# EAGLE board SAP-1 (EAGLE 9.5.1), part 1 of 2
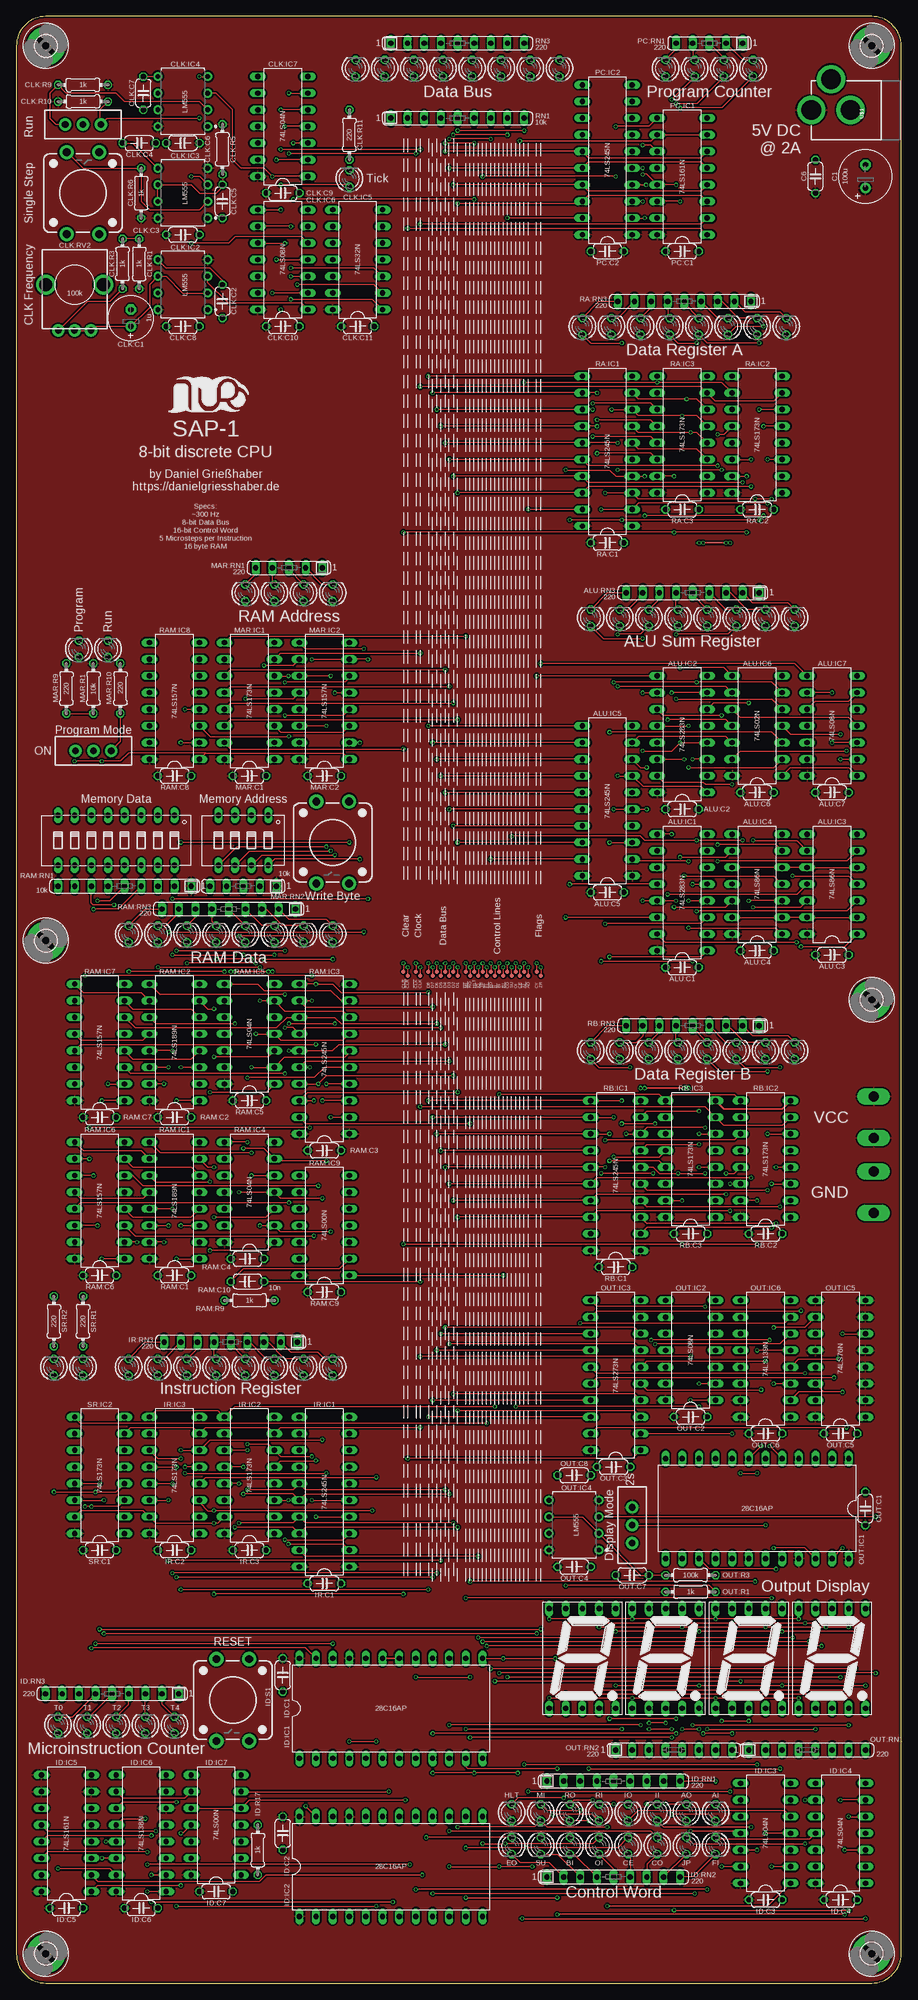
[diagram p12: board, top side]
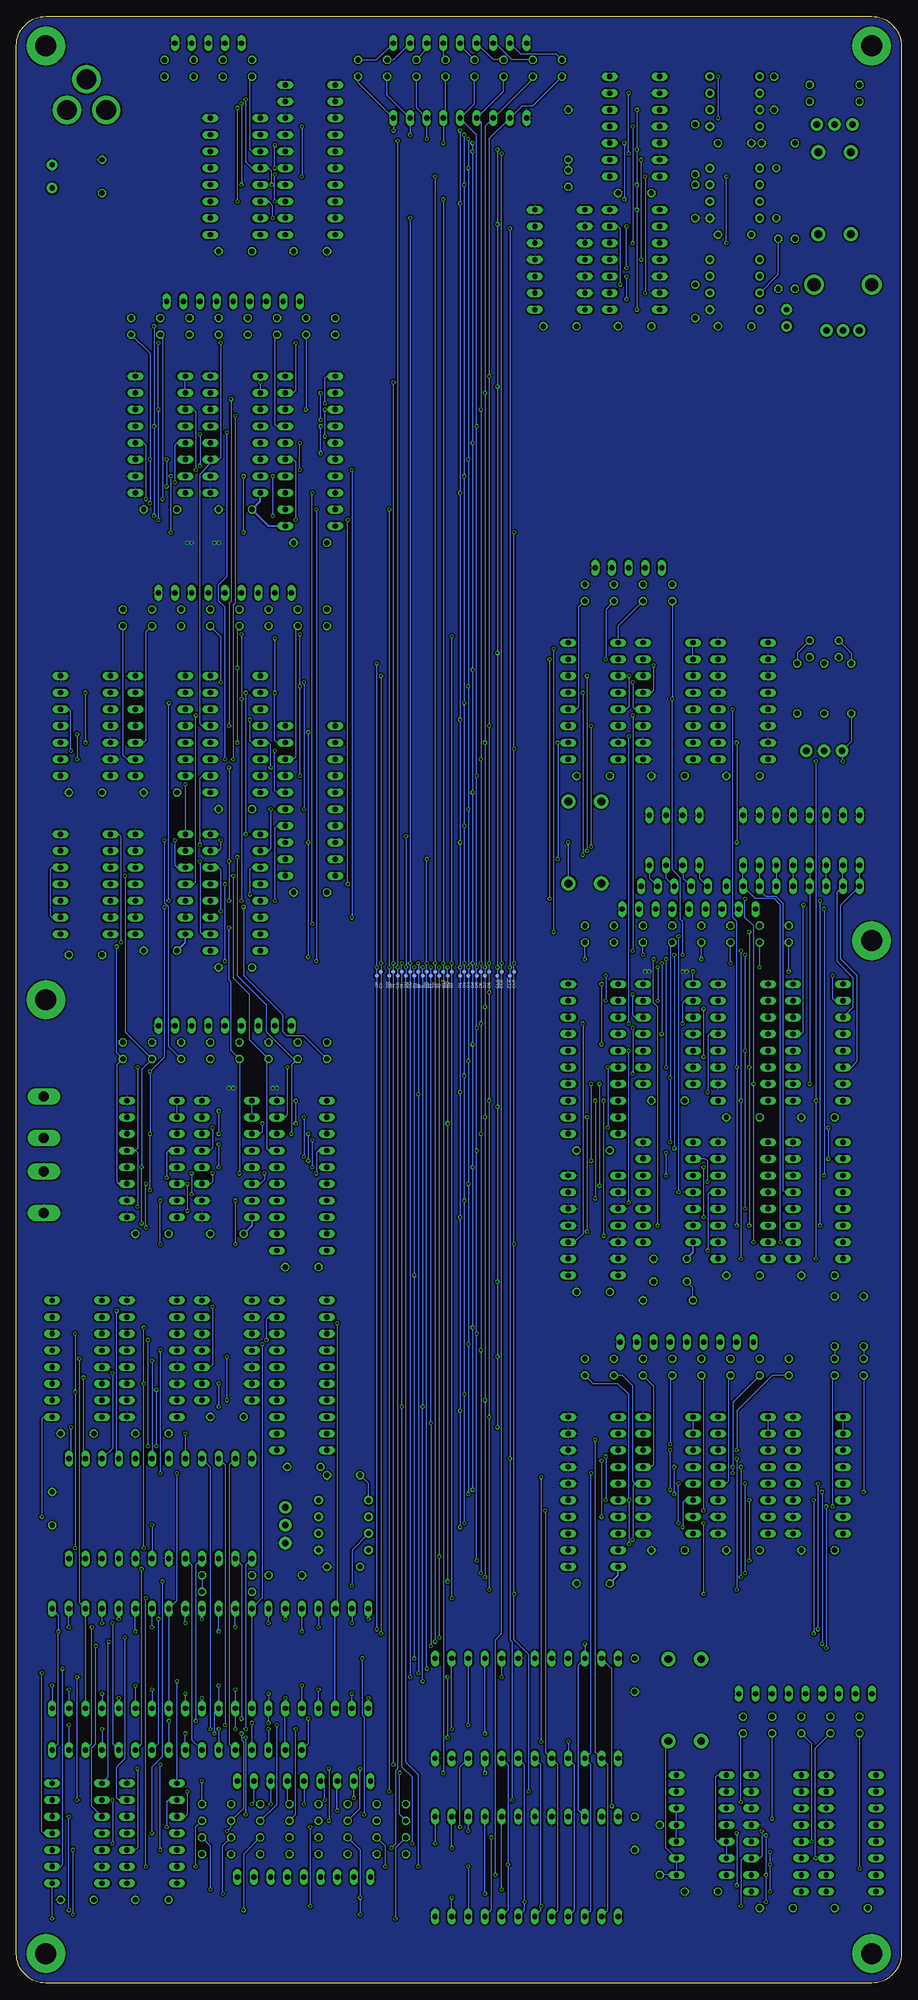
[diagram p13: board, bottom side, seen from below]

Size 135 x 300 mm. Coordinates in mm from the lower left corner, seen from the top.
Outline: 0,295.5 0,4.5 arc90 4.5,0 130.5,0 arc90 135,4.5 135,295.5 arc90 130.5,300 4.5,300 arc90 0,295.5
Copper layers (1*16): Top 0.035mm / dielectric 1.5mm / Bottom 0.035mm
Design rules "JLCPCB-Tented *": minimum track width 3.5mil, minimum drill 0.2mm, track to track 3.5mil, track to pad 5mil, pad to pad 6mil, via to via 6mil, smd to smd 3.5mil, copper to edge 0.2mm, drill to drill 5mil, minimum pad ring 3mil, minimum via ring 3mil, stop-mask expansion 4mil, vias tented up to drill 40mil, thermal gap 10mil
Net classes: 1 pwr: width 0.254 mm; 2 io: width 0.152 mm

## Footprints (pad centres in the part's own frame; a part is rotated, then mirrored left to right if it is on the bottom)
C050-024X044 = drill 0.813 octagon: 1 -2.54,0; 2 2.54,0
DIL16 = drill 0.813 long: 1 -8.89,-3.81; 2 -6.35,-3.81; 3 -3.81,-3.81; 4 -1.27,-3.81; 5 1.27,-3.81; 6 3.81,-3.81; 7 6.35,-3.81; 8 8.89,-3.81; 9 8.89,3.81; 10 6.35,3.81; 11 3.81,3.81; 12 1.27,3.81; 13 -1.27,3.81; 14 -3.81,3.81; 15 -6.35,3.81; 16 -8.89,3.81
DIL14 = drill 0.813 long: 1 -7.62,-3.81; 2 -5.08,-3.81; 3 -2.54,-3.81; 4 0,-3.81; 5 2.54,-3.81; 6 5.08,-3.81; 7 7.62,-3.81; 8 7.62,3.81; 9 5.08,3.81; 10 2.54,3.81; 11 0,3.81; 12 -2.54,3.81; 13 -5.08,3.81; 14 -7.62,3.81
DIL20 = drill 0.813 long: 1 -11.43,-3.81; 2 -8.89,-3.81; 3 -6.35,-3.81; 4 -3.81,-3.81; 5 -1.27,-3.81; 6 1.27,-3.81; 7 3.81,-3.81; 8 6.35,-3.81; 9 8.89,-3.81; 10 11.43,-3.81; 11 11.43,3.81; 12 8.89,3.81; 13 6.35,3.81; 14 3.81,3.81; 15 1.27,3.81; 16 -1.27,3.81; 17 -3.81,3.81; 18 -6.35,3.81; 19 -8.89,3.81; 20 -11.43,3.81
LED3MM = drill 0.813 octagon: A -1.27,0; K 1.27,0
SIL9 = drill 0.813 long: 1 -10.16,0; 2 -7.62,0; 3 -5.08,0; 4 -2.54,0; 5 0,0; 6 2.54,0; 7 5.08,0; 8 7.62,0; 9 10.16,0
E3,5-8 = drill 0.813 pad 1.6: + -1.778,0 | drill 0.813 pad 1.6 octagon: - 1.778,0
E2,5-7 = drill 0.813 pad 1.6: + -1.27,0 | drill 0.813 pad 1.6 octagon: - 1.27,0
DIP8 = drill 0.743 pad 1.343: 1 -3.81,3.81; 2 -3.81,1.27; 3 -3.81,-1.27; 4 -3.81,-3.81; 5 3.81,-3.81; 6 3.81,-1.27; 7 3.81,1.27; 8 3.81,3.81
0204/7 = drill 0.813 octagon: 1 -3.81,0; 2 3.81,0
ALPS_POT_KIT = drill 1 pad 1.88: P$1 7,-2.5; P$2 7,0; P$3 7,2.5 | drill 2: P$4 0,-4.4; P$5 0,4.4
TACTILE_SWITCH_PTH_12MM = drill 1.2 pad 2.159: 1 6.25,-2.5; 2 -6.25,-2.5; 3 6.25,2.5; 4 -6.25,2.5
SWITCH_SPDT_PTH_11.6X4.0MM_KIT = drill 1.016 pad 1.88: 1 0,2.718; 2 0,0; 3 0,-2.718
TP06R = smd 0.6 x 0.6: TP 0,0
3,2-PAD = drill 3.2 pad 5.842: B3,2 0,0
DIL24-6 = drill 0.813 long: 1 -13.97,-7.62; 2 -11.43,-7.62; 3 -8.89,-7.62; 4 -6.35,-7.62; 5 -3.81,-7.62; 6 -1.27,-7.62; 7 1.27,-7.62; 8 3.81,-7.62; 9 6.35,-7.62; 10 8.89,-7.62; 11 11.43,-7.62; 12 13.97,-7.62; 13 13.97,7.62; 14 11.43,7.62; 15 8.89,7.62; 16 6.35,7.62; 17 3.81,7.62; 18 1.27,7.62; 19 -1.27,7.62; 20 -3.81,7.62; 21 -6.35,7.62; 22 -8.89,7.62; 23 -11.43,7.62; 24 -13.97,7.62
VOGT-1098A.68 = drill 1.5 pad 2.5 long: P$1 -3.15,0; P$2 3.15,0
SIL5 = drill 0.813 long: 1 -5.08,0; 2 -2.54,0; 3 0,0; 4 2.54,0; 5 5.08,0
DIP04YL = drill 0.813 long: 1 -3.81,-3.81; 2 -1.27,-3.81; 3 1.27,-3.81; 4 3.81,-3.81; 5 3.81,3.81; 6 1.27,3.81; 7 -1.27,3.81; 8 -3.81,3.81
7SEG-13 = drill 0.813 long: 1 -5.08,-7.62; 2 -2.54,-7.62; 3 0,-7.62; 4 2.54,-7.62; 5 5.08,-7.62; 6 5.08,7.62; 7 2.54,7.62; 8 0,7.62; 9 -2.54,7.62; 10 -5.08,7.62
SIL8 = drill 0.813 long: 1 -8.89,0; 2 -6.35,0; 3 -3.81,0; 4 -1.27,0; 5 1.27,0; 6 3.81,0; 7 6.35,0; 8 8.89,0
DIP08YL = drill 0.813 long: 1 -8.89,-3.81; 2 -6.35,-3.81; 3 -3.81,-3.81; 4 -1.27,-3.81; 5 1.27,-3.81; 6 3.81,-3.81; 7 6.35,-3.81; 8 8.89,-3.81; 9 8.89,3.81; 10 6.35,3.81; 11 3.81,3.81; 12 1.27,3.81; 13 -1.27,3.81; 14 -3.81,3.81; 15 -6.35,3.81; 16 -8.89,3.81
POWER_JACK_PTH = drill 2.997 pad 4.318: GND 0,7.7; GNDBREAK 4.7,10.7; PWR 0,13.7

## Placement (x,y rotation side)
ALU:C1  100n  [C050-024X044]  101.6,154.94 0 top
ALU:C2  100n  [C050-024X044]  101.6,179.07 0 top
ALU:C3  100n  [C050-024X044]  124.46,156.84 0 top
ALU:C4  100n  [C050-024X044]  113.03,157.48 0 top
ALU:C5  100n  [C050-024X044]  90.17,166.37 0 top
ALU:C6  100n  [C050-024X044]  113.03,181.61 0 top
ALU:C7  100n  [C050-024X044]  124.46,181.61 0 top
ALU:IC1  74LS283N  [DIL16]  101.6,166.37 90 top
ALU:IC2  74LS283N  [DIL16]  101.6,190.5 90 top
ALU:IC3  74LS86N  [DIL14]  124.46,167.64 90 top
ALU:IC4  74LS86N  [DIL14]  113.03,167.64 90 top
ALU:IC5  74LS245N  [DIL20]  90.17,180.34 90 top
ALU:IC6  74LS02N  [DIL14]  113.03,191.77 90 top
ALU:IC7  74LS08N  [DIL14]  124.46,191.77 90 top
ALU:LED1  RED  [LED3MM]  118.75,208.28 90 top
ALU:LED2  RED  [LED3MM]  114.3,208.28 90 top
ALU:LED3  RED  [LED3MM]  109.86,208.28 90 top
ALU:LED4  RED  [LED3MM]  105.41,208.28 90 top
ALU:LED5  RED  [LED3MM]  100.97,208.28 90 top
ALU:LED6  RED  [LED3MM]  96.52,208.28 90 top
ALU:LED7  RED  [LED3MM]  92.08,208.28 90 top
ALU:LED8  RED  [LED3MM]  87.63,208.28 90 top
ALU:RN3  220  [SIL9]  103.19,212.09 180 top
C1  100u  [E3,5-8]  129.54,275.59 90 top
C6  100n  [C050-024X044]  121.92,275.59 90 top
CLK:C1  1u  [E2,5-7]  17.46,254 90 top
CLK:C2  100n  [C050-024X044]  31.43,256.54 270 top
CLK:C3  100n  [C050-024X044]  25.4,266.7 0 top
CLK:C4  100n  [C050-024X044]  18.73,280.67 0 top
CLK:C5  100n  [C050-024X044]  31.43,271.78 270 top
CLK:C6  100n  [C050-024X044]  25.4,280.67 180 top
CLK:C7  100n  [C050-024X044]  19.37,288.29 270 top
CLK:C8  100n  [C050-024X044]  25.4,252.73 0 top
CLK:C9  100n  [C050-024X044]  40.64,273.05 0 top
CLK:C10  100n  [C050-024X044]  40.64,252.73 0 top
CLK:C11  100n  [C050-024X044]  52.07,252.73 0 top
CLK:IC2  LM555  [DIP8]  25.4,259.08 180 top
CLK:IC3  LM555  [DIP8]  25.4,273.05 180 top
CLK:IC4  LM555  [DIP8]  25.4,287.02 180 top
CLK:IC5  74LS32N  [DIL14]  52.07,262.89 90 top
CLK:IC6  74LS08N  [DIL14]  40.64,262.89 90 top
CLK:IC7  74LS04N  [DIL14]  40.64,283.21 90 top
CLK:LED1  RED  [LED3MM]  50.8,275.27 90 top
CLK:R1  1k  [0204/7]  18.73,262.25 270 top
CLK:R3  1k  [0204/7]  16.19,262.25 90 top
CLK:R5  1M  [0204/7]  31.43,279.72 90 top
CLK:R6  1k  [0204/7]  19.05,273.05 270 top
CLK:R9  1k  [0204/7]  10.16,289.56 0 top
CLK:R10  1k  [0204/7]  10.16,287.02 180 top
CLK:R11  220  [0204/7]  50.8,281.94 270 top
CLK:RV2  100k  [ALPS_POT_KIT]  8.89,259.08 270 top
CLK:S1  Single Step  [TACTILE_SWITCH_PTH_12MM]  10.16,273.05 90 top
CLK:S2  Source Select  [SWITCH_SPDT_PTH_11.6X4.0MM_KIT]  10.16,283.53 90 top
CLK:TP1  TPTP06R  [TP06R]  60.96,154.31 0 bottom
CLK:TP2  TPTP06R  [TP06R]  61.59,153.67 0 bottom
CLK:TP3  TPTP06R  [TP06R]  61.59,153.67 0 top
CLK:TP4  TPTP06R  [TP06R]  60.96,154.31 0 top
H1  MOUNT-PAD-ROUND3.2  [3,2-PAD]  4.5,295.5 0 top
H2  MOUNT-PAD-ROUND3.2  [3,2-PAD]  130.5,295.5 0 top
H3  MOUNT-PAD-ROUND3.2  [3,2-PAD]  4.5,159 0 top
H4  MOUNT-PAD-ROUND3.2  [3,2-PAD]  130.5,150 0 top
H5  3.2  [3,2-PAD]  4.5,4.5 0 top
H6  3.2  [3,2-PAD]  130.5,4.5 0 top
ID:AI  RED  [LED3MM]  106.68,26.04 90 top
ID:AO  RED  [LED3MM]  102.23,26.04 90 top
ID:BI  RED  [LED3MM]  84.45,20.95 270 top
ID:C1  100n  [C050-024X044]  40.64,46.99 270 top
ID:C2  100n  [C050-024X044]  40.64,22.86 270 top
ID:C3  100n  [C050-024X044]  114.3,12.7 0 top
ID:C4  100n  [C050-024X044]  125.73,12.7 0 top
ID:C5  100n  [C050-024X044]  7.62,11.43 0 top
ID:C6  100n  [C050-024X044]  19.05,11.43 0 top
ID:C7  100n  [C050-024X044]  30.48,13.97 0 top
ID:CE  RED  [LED3MM]  93.34,20.95 270 top
ID:CO  RED  [LED3MM]  97.79,20.95 270 top
ID:EO  RED  [LED3MM]  75.56,20.95 270 top
ID:FI  RED  [LED3MM]  106.68,20.95 270 top
ID:HLT  RED  [LED3MM]  75.56,26.04 90 top
ID:IC1  28C16AP  [DIL24-6]  57.15,41.91 0 top
ID:IC2  28C16AP  [DIL24-6]  57.15,17.78 0 top
ID:IC3  74LS04N  [DIL14]  114.3,22.86 90 top
ID:IC4  74LS04N  [DIL14]  125.73,22.86 90 top
ID:IC5  74LS161N  [DIL16]  7.62,22.86 90 top
ID:IC6  74LS138N  [DIL16]  19.05,22.86 90 top
ID:IC7  74LS00N  [DIL14]  30.48,24.13 90 top
ID:II  RED  [LED3MM]  97.79,26.04 90 top
ID:IO  RED  [LED3MM]  93.34,26.04 90 top
ID:JP  RED  [LED3MM]  102.23,20.95 270 top
ID:MI  RED  [LED3MM]  80.01,26.04 90 top
ID:OI  RED  [LED3MM]  88.9,20.95 270 top
ID:R17  1k  [0204/7]  36.83,20.32 270 top
ID:RI  RED  [LED3MM]  88.9,26.04 90 top
ID:RN1  220  [SIL9]  91.12,30.8 0 top
ID:RN2  220  [SIL9]  91.12,16.19 0 top
ID:RN3  220  [SIL9]  14.61,44.13 180 top
ID:RO  RED  [LED3MM]  84.45,26.04 90 top
ID:S1  Reset  [TACTILE_SWITCH_PTH_12MM]  33.02,43.18 270 top
ID:SU  RED  [LED3MM]  80.01,20.95 270 top
ID:T0  GREEN  [LED3MM]  6.35,39.37 90 top
ID:T1  GREEN  [LED3MM]  10.79,39.37 90 top
ID:T2  GREEN  [LED3MM]  15.24,39.37 90 top
ID:T3  GREEN  [LED3MM]  19.68,39.37 90 top
ID:T4  GREEN  [LED3MM]  24.13,39.37 90 top
ID:TP1  TPTP06R  [TP06R]  69.85,154.31 0 bottom
ID:TP2  TPTP06R  [TP06R]  68.58,154.31 0 bottom
ID:TP3  TPTP06R  [TP06R]  69.22,153.67 0 bottom
ID:TP4  TPTP06R  [TP06R]  74.3,153.67 0 bottom
ID:TP5  TPTP06R  [TP06R]  70.48,153.67 0 bottom
ID:TP6  TPTP06R  [TP06R]  73.03,153.67 0 bottom
ID:TP7  TPTP06R  [TP06R]  78.11,153.67 0 bottom
ID:TP8  TPTP06R  [TP06R]  77.47,154.31 0 bottom
ID:TP9  TPTP06R  [TP06R]  72.39,154.31 0 bottom
ID:TP10  TPTP06R  [TP06R]  75.56,153.67 0 bottom
ID:TP11  TPTP06R  [TP06R]  73.66,154.31 0 bottom
ID:TP12  TPTP06R  [TP06R]  76.2,154.31 0 bottom
ID:TP13  TPTP06R  [TP06R]  76.83,153.67 0 bottom
ID:TP14  TPTP06R  [TP06R]  74.93,154.31 0 bottom
ID:TP15  TPTP06R  [TP06R]  71.12,154.31 0 bottom
ID:TP16  TPTP06R  [TP06R]  71.75,153.67 0 bottom
ID:TP17  TPTP06R  [TP06R]  59.05,154.31 0 bottom
ID:TP18  TPTP06R  [TP06R]  59.69,153.67 0 bottom
ID:TP19  TPTP06R  [TP06R]  69.85,154.31 0 top
ID:TP20  TPTP06R  [TP06R]  68.58,154.31 0 top
ID:TP21  TPTP06R  [TP06R]  69.22,153.67 0 top
ID:TP22  TPTP06R  [TP06R]  74.3,153.67 0 top
ID:TP23  TPTP06R  [TP06R]  70.48,153.67 0 top
ID:TP24  TPTP06R  [TP06R]  73.03,153.67 0 top
ID:TP25  TPTP06R  [TP06R]  78.11,153.67 0 top
ID:TP26  TPTP06R  [TP06R]  77.47,154.31 0 top
ID:TP27  TPTP06R  [TP06R]  72.39,154.31 0 top
ID:TP28  TPTP06R  [TP06R]  75.56,153.67 0 top
ID:TP29  TPTP06R  [TP06R]  73.66,154.31 0 top
ID:TP30  TPTP06R  [TP06R]  76.2,154.31 0 top
ID:TP31  TPTP06R  [TP06R]  76.83,153.67 0 top
ID:TP32  TPTP06R  [TP06R]  74.93,154.31 0 top
ID:TP33  TPTP06R  [TP06R]  71.12,154.31 0 top
ID:TP34  TPTP06R  [TP06R]  71.75,153.67 0 top
ID:TP35  TPTP06R  [TP06R]  59.69,153.67 0 top
ID:TP36  TPTP06R  [TP06R]  59.05,154.31 0 top
IR:C1  100n  [C050-024X044]  46.99,60.96 0 top
IR:C2  100n  [C050-024X044]  24.13,66.04 0 top
IR:C3  100n  [C050-024X044]  35.56,66.04 0 top
IR:IC1  74LS245N  [DIL20]  46.99,74.93 90 top
IR:IC2  74LS173N  [DIL16]  35.56,77.47 90 top
IR:IC3  74LS173N  [DIL16]  24.13,77.47 90 top
IR:LED1  RED  [LED3MM]  48.26,93.98 90 top
IR:LED2  RED  [LED3MM]  43.81,93.98 90 top
IR:LED3  RED  [LED3MM]  39.37,93.98 90 top
IR:LED4  RED  [LED3MM]  34.92,93.98 90 top
IR:LED5  BLUE  [LED3MM]  30.48,93.98 90 top
IR:LED6  BLUE  [LED3MM]  26.04,93.98 90 top
IR:LED7  BLUE  [LED3MM]  21.59,93.98 90 top
IR:LED8  BLUE  [LED3MM]  17.14,93.98 90 top
IR:RN3  220  [SIL9]  32.7,97.79 180 top
J1  TERMINAL-1BRIDGE  [VOGT-1098A.68]  130.81,132.08 90 top
J2  TERMINAL-1BRIDGE  [VOGT-1098A.68]  130.81,120.65 90 top
LED1  RED  [LED3MM]  82.87,292.1 90 top
LED2  RED  [LED3MM]  78.42,292.1 90 top
LED3  RED  [LED3MM]  73.98,292.1 90 top
LED4  RED  [LED3MM]  69.53,292.1 90 top
LED5  RED  [LED3MM]  65.09,292.1 90 top
LED6  RED  [LED3MM]  60.64,292.1 90 top
LED7  RED  [LED3MM]  56.2,292.1 90 top
LED8  RED  [LED3MM]  51.75,292.1 90 top
MAR:C1  100n  [C050-024X044]  35.56,184.15 0 top
MAR:C2  100n  [C050-024X044]  46.99,184.15 0 top
MAR:IC1  74LS173N  [DIL16]  35.56,195.58 90 top
MAR:IC2  74LS157N  [DIL16]  46.99,195.58 90 top
MAR:LED1  BLUE  [LED3MM]  48.26,212.09 90 top
MAR:LED2  BLUE  [LED3MM]  43.81,212.09 90 top
MAR:LED3  BLUE  [LED3MM]  39.37,212.09 90 top
MAR:LED4  BLUE  [LED3MM]  34.92,212.09 90 top
MAR:PROG  RED  [LED3MM]  9.53,203.52 90 top
MAR:R1  10k  [0204/7]  11.75,197.49 270 top
MAR:R9  220  [0204/7]  7.62,197.49 270 top
MAR:R10  220  [0204/7]  15.88,197.49 270 top
MAR:RN1  220  [SIL5]  41.59,215.9 180 top
MAR:RN2  10k  [SIL5]  34.61,167.32 180 top
MAR:RUN  GREEN  [LED3MM]  13.97,203.52 90 top
MAR:S1  Memory Address  [DIP04YL]  34.61,174.31 180 top
MAR:S3  Program / Write  [SWITCH_SPDT_PTH_11.6X4.0MM_KIT]  11.75,187.96 90 top
OUT:C1  100n  [C050-024X044]  129.54,72.39 90 top
OUT:C2  100n  [C050-024X044]  102.87,86.36 0 top
OUT:C3  100n  [C050-024X044]  91.12,78.74 0 top
OUT:C4  100n  [C050-024X044]  85.09,63.5 0 top
OUT:C5  100n  [C050-024X044]  125.73,83.82 0 top
OUT:C6  100n  [C050-024X044]  114.3,83.82 0 top
OUT:C7  10n  [C050-024X044]  93.98,62.23 180 top
OUT:C8  100n  [C050-024X044]  85.09,77.47 0 top
OUT:D1  RED  [7SEG-13]  124.46,49.53 0 top
OUT:D2  RED  [7SEG-13]  111.76,49.53 0 top
OUT:D3  RED  [7SEG-13]  99.06,49.53 0 top
OUT:D4  RED  [7SEG-13]  86.36,49.53 0 top
OUT:IC1  28C16AP  [DIL24-6]  113.03,72.39 180 top
OUT:IC2  74LS08N  [DIL14]  102.87,96.52 90 top
OUT:IC3  74LS273N  [DIL20]  91.44,92.71 90 top
OUT:IC4  LM555  [DIP8]  85.09,69.85 180 top
OUT:IC5  74LS76N  [DIL16]  125.73,95.25 90 top
OUT:IC6  74LS139N  [DIL16]  114.3,95.25 90 top
OUT:R1  1k  [0204/7]  102.87,59.69 180 top
OUT:R3  100k  [0204/7]  102.87,62.23 0 top
OUT:RN1  220  [SIL8]  120.65,35.56 0 top
OUT:RN2  220  [SIL8]  100.33,35.56 0 top
OUT:S3  2's Complement  [SWITCH_SPDT_PTH_11.6X4.0MM_KIT]  93.98,69.85 180 top
PC:C1  100n  [C050-024X044]  101.6,264.16 0 top
PC:C2  100n  [C050-024X044]  90.17,264.16 180 top
PC:IC1  74LS161N  [DIL16]  101.6,275.59 90 top
PC:IC2  74LS245N  [DIL20]  90.17,278.13 90 top
PC:LED1  BLUE  [LED3MM]  112.39,292.1 90 top
PC:LED2  BLUE  [LED3MM]  107.95,292.1 90 top
PC:LED3  BLUE  [LED3MM]  103.5,292.1 90 top
PC:LED4  BLUE  [LED3MM]  99.06,292.1 90 top
PC:RN1  220  [SIL5]  105.73,295.91 180 top
RA:C1  100n  [C050-024X044]  90.17,219.71 0 top
RA:C2  100n  [C050-024X044]  113.03,224.79 0 top
RA:C3  100n  [C050-024X044]  101.6,224.79 0 top
RA:IC1  74LS245N  [DIL20]  90.17,233.68 90 top
RA:IC2  74LS173N  [DIL16]  113.03,236.22 90 top
RA:IC3  74LS173N  [DIL16]  101.6,236.22 90 top
RA:LED1  RED  [LED3MM]  117.47,252.73 90 top
RA:LED2  RED  [LED3MM]  113.03,252.73 90 top
RA:LED3  RED  [LED3MM]  108.58,252.73 90 top
RA:LED4  RED  [LED3MM]  104.14,252.73 90 top
RA:LED5  RED  [LED3MM]  99.69,252.73 90 top
RA:LED6  RED  [LED3MM]  95.25,252.73 90 top
RA:LED7  RED  [LED3MM]  90.81,252.73 90 top
RA:LED8  RED  [LED3MM]  86.36,252.73 90 top
RA:RN3  220  [SIL9]  101.92,256.54 180 top
RAM:C1  100n  [C050-024X044]  24.13,107.95 0 top
RAM:C2  100n  [C050-024X044]  24.13,132.08 0 top
RAM:C3  100n  [C050-024X044]  46.99,127 0 top
RAM:C4  100n  [C050-024X044]  35.24,110.49 0 top
RAM:C5  100n  [C050-024X044]  35.56,134.62 0 top
RAM:C6  100n  [C050-024X044]  12.7,107.95 0 top
RAM:C7  100n  [C050-024X044]  12.7,132.08 0 top
RAM:C8  100n  [C050-024X044]  24.13,184.15 0 top
RAM:C9  100n  [C050-024X044]  46.99,105.41 0 top
RAM:C10  10n  [C050-024X044]  35.24,107 180 top
RAM:IC1  74LS189N  [DIL16]  24.13,119.38 90 top
RAM:IC2  74LS189N  [DIL16]  24.13,143.51 90 top
RAM:IC3  74LS245N  [DIL20]  46.99,140.97 90 top
RAM:IC4  74LS04N  [DIL14]  35.56,120.65 90 top
RAM:IC5  74LS04N  [DIL14]  35.56,144.78 90 top
RAM:IC6  74LS157N  [DIL16]  12.7,119.38 90 top
RAM:IC7  74LS157N  [DIL16]  12.7,143.51 90 top
RAM:IC8  74LS157N  [DIL16]  24.13,195.58 90 top
RAM:IC9  74LS00N  [DIL14]  46.99,115.57 90 top
RAM:LED1  RED  [LED3MM]  48.26,160.02 90 top
RAM:LED2  RED  [LED3MM]  43.81,160.02 90 top
RAM:LED3  RED  [LED3MM]  39.37,160.02 90 top
RAM:LED4  RED  [LED3MM]  34.92,160.02 90 top
RAM:LED5  RED  [LED3MM]  30.48,160.02 90 top
RAM:LED6  RED  [LED3MM]  26.04,160.02 90 top
RAM:LED7  RED  [LED3MM]  21.59,160.02 90 top
RAM:LED8  RED  [LED3MM]  17.14,160.02 90 top
RAM:R9  1k  [0204/7]  35.56,104.14 180 top
RAM:RN1  10k  [SIL9]  16.51,167.32 180 top
RAM:RN3  220  [SIL9]  32.38,163.83 180 top
RAM:S1  Write Byte  [TACTILE_SWITCH_PTH_12MM]  48.26,173.99 270 top
RAM:S2  Memory Data  [DIP08YL]  15.24,174.31 180 top
RB:C1  100n  [C050-024X044]  91.44,109.22 0 top
RB:C2  100n  [C050-024X044]  114.3,114.3 0 top
RB:C3  100n  [C050-024X044]  102.87,114.3 0 top
RB:IC1  74LS245N  [DIL20]  91.44,123.19 90 top
RB:IC2  74LS173N  [DIL16]  114.3,125.73 90 top
RB:IC3  74LS173N  [DIL16]  102.87,125.73 90 top
RB:LED1  RED  [LED3MM]  118.75,142.24 90 top
RB:LED2  RED  [LED3MM]  114.3,142.24 90 top
RB:LED3  RED  [LED3MM]  109.86,142.24 90 top
RB:LED4  RED  [LED3MM]  105.41,142.24 90 top
RB:LED5  RED  [LED3MM]  100.97,142.24 90 top
RB:LED6  RED  [LED3MM]  96.52,142.24 90 top
RB:LED7  RED  [LED3MM]  92.08,142.24 90 top
RB:LED8  RED  [LED3MM]  87.63,142.24 90 top
RB:RN3  220  [SIL9]  103.19,146.05 180 top
RN1  10k  [SIL9]  67.31,284.48 0 top
RN3  220  [SIL9]  67.31,295.91 0 top
SR:C1  100n  [C050-024X044]  12.7,66.04 0 top
SR:IC2  74LS173N  [DIL16]  12.7,77.47 90 top
SR:LED1  BLUE  [LED3MM]  5.71,93.98 90 top
SR:LED2  BLUE  [LED3MM]  10.16,93.98 90 top
SR:R1  220  [0204/7]  10.16,100.97 270 top
SR:R2  220  [0204/7]  5.71,100.97 270 top
SR:TP1  TPTP06R  [TP06R]  79.38,154.31 0 bottom
SR:TP2  TPTP06R  [TP06R]  80.01,153.67 0 bottom
SR:TP3  TPTP06R  [TP06R]  80.01,153.67 0 top
SR:TP4  TPTP06R  [TP06R]  79.38,154.31 0 top
TP1  TPTP06R  [TP06R]  62.87,154.31 0 bottom
TP2  TPTP06R  [TP06R]  63.5,153.67 0 bottom
TP3  TPTP06R  [TP06R]  64.14,154.31 0 bottom
TP4  TPTP06R  [TP06R]  64.77,153.67 0 bottom
TP5  TPTP06R  [TP06R]  65.41,154.31 90 bottom
TP6  TPTP06R  [TP06R]  66.04,153.67 90 bottom
TP7  TPTP06R  [TP06R]  66.67,154.31 90 bottom
TP8  TPTP06R  [TP06R]  67.31,153.67 90 bottom
TP9  TPTP06R  [TP06R]  62.87,154.31 0 top
TP10  TPTP06R  [TP06R]  63.5,153.67 0 top
TP11  TPTP06R  [TP06R]  64.14,154.31 0 top
TP12  TPTP06R  [TP06R]  64.77,153.67 0 top
TP13  TPTP06R  [TP06R]  65.41,154.31 0 top
TP14  TPTP06R  [TP06R]  66.04,153.67 0 top
TP15  TPTP06R  [TP06R]  66.67,154.31 0 top
TP16  TPTP06R  [TP06R]  67.31,153.67 0 top
U$1  DC-JACK  [POWER_JACK_PTH]  135,285.72 90 top
U$2  [LOGO-SILKSCREEN]  29.21,241.3 0 top

## Tracks (layer width: path | path; a pad name or v marks a point on that pad's centre or on a via)
!AI  (via drill 0.38)
  Top 0.152: ID:IC3.12 v113.03,20.32 | v113.03,33.34 v77.47,33.34 | RA:IC2.10 107.63,244.16 v97.79,244.16 v77.47,244.16 | ID:TP26.TP v77.47,155.57
  Bottom 0.152: v113.03,20.32 v113.03,33.34 | v77.47,33.34 ID:TP26.TP v77.47,155.57 v77.47,244.16 | RA:IC2.10 RA:IC2.9 | RA:IC3.9 v97.79,244.16 RA:IC3.10
!AO  (via drill 0.38)
  Top 0.152: v108.9,29.21 v78.11,29.21 | RA:IC1.19 v78.11,224.79 | ID:TP25.TP v78.11,154.94
  Bottom 0.152: ID:IC3.10 109.22,25.4 108.9,25.72 v108.9,29.21 | v78.11,224.79 v78.11,154.94 ID:TP25.TP v78.11,29.21
!BI  (via drill 0.38)
  Top 0.152: v131.13,47.31 v73.66,47.31 | RB:IC2.9 109.54,135.57 100.01,135.57 RB:IC3.9 98.11,135.57 v73.66,135.57 | ID:TP29.TP v73.66,155.57
  Bottom 0.152: ID:IC4.4 130.81,22.86 131.13,23.18 v131.13,47.31 | v73.66,47.31 v73.66,135.57 ID:TP29.TP v73.66,155.57 | RB:IC2.10 RB:IC2.9 | RB:IC3.10 RB:IC3.9
!CLK  (via drill 0.38)
  Top 0.152: v60.96,279.08 v41.59,279.08 | ID:IC5.2 12.38,15.56 37.15,15.56 38.1,16.51 v61.91,16.51 | v60.96,155.57 CLK:TP4.TP | v41.59,288.29 CLK:IC7.6
  Bottom 0.152: v60.96,279.08 v60.96,155.57 CLK:TP4.TP 60.96,53.34 61.91,52.39 v61.91,16.51 | v41.59,279.08 v41.59,288.29
!CLR  (via drill 0.38)
  Top 0.152: v59.37,27.94 35.56,27.94 ID:IC7.5 ID:IC7.10 | PC:IC1.1 104.46,267.65 v59.69,267.65 | OUT:IC3.1 93.98,80.01 v59.69,80.01 | v59.69,154.94 ID:TP35.TP
  Bottom 0.152: v59.69,267.65 v59.69,154.94 ID:TP35.TP v59.69,80.01 59.69,52.39 59.37,52.07 v59.37,27.94 | ID:IC7.3 ID:IC7.4 ID:IC7.5
!CO  (via drill 0.38)
  Top 0.152: ID:IC4.6 v125.73,27.94 | v125.73,46.67 v74.93,46.67 | PC:IC2.19 v74.93,269.24 | ID:TP32.TP v74.93,155.57
  Bottom 0.152: v125.73,27.94 v125.73,46.67 | v74.93,269.24 v74.93,155.57 ID:TP32.TP v74.93,46.67
!EO  (via drill 0.38)
  Top 0.152: v127.95,47.94 v72.39,47.94 | ALU:IC5.19 v72.39,171.45 | v72.39,155.57 ID:TP27.TP
  Bottom 0.152: ID:IC4.2 128.27,17.78 127.95,18.1 v127.95,47.94 | v72.39,47.94 ID:TP27.TP v72.39,155.57 v72.39,171.45
!FI  (via drill 0.38)
  Top 0.152: v122.87,51.44 v71.75,51.44 | SR:IC2.9 9.84,85.41 v71.75,85.41 | v71.75,154.94 ID:TP34.TP
  Bottom 0.152: ID:IC4.10 123.51,26.99 123.51,35.88 122.87,36.51 v122.87,51.44 | v71.75,51.44 v71.75,85.41 ID:TP34.TP v71.75,154.94 | SR:IC2.9 SR:IC2.10
!II  (via drill 0.38)
  Top 0.152: v110.49,46.04 v73.03,46.04 | IR:IC3.9 21.27,87.31 30.8,87.31 IR:IC2.9 33.34,87.95 v73.03,87.95 | v73.03,154.94 ID:TP24.TP
  Bottom 0.152: ID:IC3.8 v110.49,46.04 | v73.03,46.04 v73.03,87.95 ID:TP24.TP v73.03,154.94 | IR:IC3.9 IR:IC3.10 | IR:IC2.9 IR:IC2.10
!IO  (via drill 0.38)
  Top 0.152: v118.43,52.7 v70.48,52.7 | IR:IC1.19 44.13,65.09 v70.48,65.09 | v70.48,154.94 ID:TP23.TP
  Bottom 0.152: ID:IC3.6 119.38,27.94 119.7,28.26 119.7,33.02 118.43,34.29 v118.43,52.7 | v70.48,52.7 v70.48,65.09 ID:TP23.TP v70.48,154.94
!JP  (via drill 0.38)
  Top 0.152: v120.97,52.07 v71.12,52.07 | PC:IC1.9 96.52,283.21 v91.44,283.21 | v91.44,275.59 v71.12,275.59 | v71.12,155.57 ID:TP33.TP
  Bottom 0.152: ID:IC4.8 120.97,31.43 v120.97,52.07 | v71.12,275.59 v71.12,155.57 ID:TP33.TP v71.12,52.07 | v91.44,283.21 v91.44,275.59
!MI  (via drill 0.38)
  Top 0.152: ID:IC3.2 v115.25,17.78 | v115.25,58.74 v68.58,58.74 | MAR:IC1.9 32.7,205.42 v68.58,205.42 | v68.58,155.57 ID:TP20.TP
  Bottom 0.152: v115.25,17.78 v115.25,58.74 | v68.58,205.42 v68.58,155.57 ID:TP20.TP v68.58,58.74 | MAR:IC1.10 MAR:IC1.9
!RO  (via drill 0.38)
  Top 0.152: ID:IC3.4 v114.3,22.86 | v112.71,61.28 v69.22,61.28 | RAM:IC3.19 44.13,131.13 v69.22,131.13 | v69.22,154.94 ID:TP21.TP
  Bottom 0.152: v114.3,22.86 114.3,33.02 112.71,34.61 v112.71,61.28 | v69.22,61.28 v69.22,131.13 ID:TP21.TP v69.22,154.94
ALU:N$1  (via drill 0.38)
  Top 0.152: ALU:IC2.7 v100.01,196.85 | v100.01,175.26 ALU:IC1.9
  Bottom 0.152: v100.01,196.85 v100.01,175.26
ALU:N$2
  Top 0.152: ALU:IC6.1 118.11,185.42 127,185.42 ALU:IC7.1
ALU:N$3  (via drill 0.38)
  Top 0.152: ALU:IC6.4 118.11,190.5 v125.73,190.5 | v125.73,186.69 ALU:IC7.2
  Bottom 0.152: v125.73,190.5 v125.73,186.69
ALU:N$4
  Top 0.152: ALU:IC7.4 127,193.04 110.49,193.04 ALU:IC6.10
ALU:N$5  (via drill 0.38)
  Top 0.152: ALU:IC6.13 110.49,187.96 v126.68,187.96
  Bottom 0.152: v126.68,187.96 126.68,193.99 127,194.31 ALU:IC7.5
ALU:N$6  (via drill 0.38)
  Top 0.152: ALU:IC7.3 v124.46,189.23 | v124.46,196.85 ALU:IC7.9
  Bottom 0.152: v124.46,189.23 v124.46,196.85
ALU:N$7
  Top 0.152: ALU:IC7.10 121.92,195.58 127,195.58 ALU:IC7.6
ALU:N$8
  Top 0.152: ALU:LED8.K 90.17,212.09 ALU:RN3.9
ALU:N$9
  Top 0.152: ALU:RN3.8 95.57,211.77 93.34,209.55 ALU:LED7.K
ALU:N$10
  Top 0.152: ALU:LED6.K 97.79,210.82 97.79,211.77 ALU:RN3.7
ALU:N$11
  Top 0.152: ALU:LED5.K 100.65,209.87 ALU:RN3.6
ALU:N$12
  Top 0.152: ALU:LED4.K 103.19,211.77 ALU:RN3.5
ALU:N$13
  Top 0.152: ALU:LED3.K 108.27,209.55 ALU:RN3.4
ALU:N$14
  Top 0.152: ALU:LED2.K 111.44,209.55 108.9,212.09 ALU:RN3.3
ALU:N$15
  Top 0.152: ALU:LED1.K 117.79,210.5 112.39,210.5 ALU:RN3.2
ALU:N$18  (via drill 0.38)
  Top 0.152: ALU:IC3.3 126.68,163.51 v103.82,163.51
  Bottom 0.152: v103.82,163.51 103.82,169.86 104.14,170.18 ALU:IC1.6
ALU:N$19  (via drill 0.38)
  Top 0.152: ALU:IC3.6 126.68,171.13 v107,171.13
  Bottom 0.152: v107,171.13 107,160.34 106.68,160.02 ALU:IC1.2
ALU:N$20  (via drill 0.38)
  Top 0.152: v119.06,158.75 99.06,158.75 ALU:IC1.15
  Bottom 0.152: ALU:IC3.8 119.38,175.26 119.06,174.94 v119.06,158.75
ALU:N$21  (via drill 0.38)
  Top 0.152: ALU:IC3.11 119.06,166.05 v99.38,166.05
  Bottom 0.152: ALU:IC1.11 99.06,170.18 99.38,169.86 v99.38,166.05
ALU:N$22  (via drill 0.38)
  Top 0.152: ALU:IC4.3 v111.76,165.1 | v111.76,195.26 106.36,195.26 ALU:IC2.6
  Bottom 0.152: v111.76,165.1 v111.76,195.26
ALU:N$23  (via drill 0.38)
  Top 0.152: ALU:IC4.6 115.89,173.67 v107,173.67
  Bottom 0.152: v107,173.67 107,183.83 106.68,184.15 ALU:IC2.2
ALU:N$24  (via drill 0.38)
  Top 0.152: ALU:IC2.15 98.74,183.2 104.78,183.2 105.09,182.88 v109.22,182.88
  Bottom 0.152: v109.22,182.88 ALU:IC4.8
ALU:N$25  (via drill 0.38)
  Top 0.152: v107.63,193.36 98.74,193.36 ALU:IC2.11
  Bottom 0.152: ALU:IC4.11 107.95,167.64 107.63,167.96 v107.63,193.36
ALU:S1  (via drill 0.38)
  Top 0.152: ALU:IC5.2 94.3,171.13 v102.55,171.13 | v102.55,165.1 ALU:IC1.4 | v102.55,185.42 115.57,185.42 ALU:IC6.2
  Bottom 0.152: v102.55,165.1 v102.55,171.13 v102.55,185.42 | ALU:LED1.A 118.75,187.32 118.11,186.69 ALU:IC6.2
ALU:S2  (via drill 0.38)
  Top 0.152: ALU:IC1.1 104.46,156.53 v90.49,156.53 | v90.49,173.99 ALU:IC5.3 | v90.49,190.82 115.25,190.82 ALU:IC6.3
  Bottom 0.152: v90.49,156.53 v90.49,173.99 v90.49,190.82 | ALU:LED2.A 115.25,206.06 115.25,189.55 115.57,189.23 ALU:IC6.3
ALU:S3  (via drill 0.38)
  Top 0.152: v95.57,165.1 ALU:IC1.13 v100.65,165.1 | ALU:IC6.5 115.25,195.9 v100.65,195.9 | ALU:LED3.A 108.58,205.74 v100.65,205.74
  Bottom 0.152: ALU:IC5.4 95.25,176.53 95.57,176.21 v95.57,165.1 | v100.65,165.1 v100.65,195.9 v100.65,205.74
ALU:S4  (via drill 0.38)
  Top 0.152: v96.2,179.07 ALU:IC5.5 v91.12,179.07 | ALU:IC6.6 115.25,198.44 v103.82,198.44 v91.12,198.44
  Bottom 0.152: v96.2,179.07 96.2,173.04 96.52,172.72 ALU:IC1.10 | v91.12,198.44 v91.12,179.07 | ALU:LED4.A 103.82,205.42 v103.82,198.44
ALU:S5  (via drill 0.38)
  Top 0.152: v95.57,187.96 100.01,187.96 v101.28,189.23 ALU:IC2.4 | ALU:IC6.8 107.95,200.66 v101.28,200.66
  Bottom 0.152: ALU:IC5.6 95.25,181.61 95.57,181.93 v95.57,187.96 | v101.28,189.23 v101.28,200.66 101.28,206.69 ALU:LED5.A
ALU:S6  (via drill 0.38)
  Top 0.152: ALU:IC2.1 104.46,182.56 95.57,182.56 ALU:IC5.7 v91.76,184.15 | ALU:IC6.9 108.27,197.8 v91.76,197.8 | ALU:LED6.A 95.25,205.74 v91.76,205.74
  Bottom 0.152: v91.76,184.15 v91.76,197.8 v91.76,205.74
ALU:S7  (via drill 0.38)
  Top 0.152: ALU:IC5.8 95.25,185.42 v96.2,185.42 | v99.38,192.72 108.27,192.72 ALU:IC6.11
  Bottom 0.152: v96.2,185.42 96.2,188.91 96.52,189.23 ALU:IC2.13 99.06,189.23 99.38,189.55 v99.38,192.72 | ALU:LED7.A 92.39,206.69 92.39,187.01 92.71,186.69 ALU:IC5.8
ALU:S8  (via drill 0.38)
  Top 0.152: v95.57,196.85 ALU:IC2.10 | ALU:IC6.12 108.27,190.18 94.93,190.18 ALU:IC5.9 | ALU:LED8.A 89.53,205.1 v95.57,205.1
  Bottom 0.152: ALU:IC5.9 95.25,189.23 95.57,189.55 v95.57,196.85 v95.57,205.1
CE  (via drill 0.38)
  Top 0.152: v68.58,20.64 v77.79,20.64 91.76,20.64 ID:CE.A | v76.83,280.99 96.84,280.99 PC:IC1.10 PC:IC1.7 | ID:TP31.TP v76.83,154.94
  Bottom 0.152: v68.58,20.64 ID:IC2.14 | v77.79,20.64 77.15,21.27 77.15,32.38 76.83,32.7 ID:TP31.TP v76.83,154.94 v76.83,280.99
CF  (via drill 0.38)
  Top 0.152: v10.48,72.71 v11.43,72.71 15.56,72.71 SR:IC2.3 | v11.43,51.12 44.13,51.12 ID:IC1.23 | ID:IC2.23 v44.13,26.99
  Bottom 0.152: SR:LED2.A 10.48,92.39 v10.48,72.71 | v11.43,72.71 v11.43,51.12 | v44.13,26.99 44.13,47.94 ID:IC1.23
CLK  (via drill 0.38)
  Top 0.152: v40.32,279.72 v61.59,279.72 | PC:IC1.2 104.46,268.29 v61.59,268.29 | RA:IC2.7 115.57,241.3 106.68,241.3 RA:IC3.7 104.46,243.52 v61.59,243.52 | v61.59,133.67 105.09,133.67 RB:IC3.7 107.95,130.81 116.84,130.81 RB:IC2.7 | OUT:IC2.1 v102.87,88.9 | v102.87,95.57 v61.59,95.57 | SR:IC2.7 17.46,84.77 26.99,84.77 IR:IC3.7 28.89,84.77 38.42,84.77 IR:IC2.7 40.32,84.77 v61.59,84.77 | RAM:C10.1 v61.59,107 | MAR:IC1.7 40.32,202.88 v61.59,202.88 | CLK:LED1.A 50.48,274.32 v40.32,274.32 | v61.59,154.94 CLK:TP3.TP | CLK:IC7.5 v40.32,285.75 | CLK:IC6.8 v40.32,270.51
  Bottom 0.152: v61.59,279.72 v61.59,268.29 v61.59,243.52 v61.59,202.88 v61.59,154.94 CLK:TP3.TP v61.59,133.67 v61.59,107 v61.59,95.57 v61.59,84.77 | v102.87,88.9 v102.87,95.57 | v40.32,255.27 v40.32,270.51 v40.32,274.32 v40.32,279.72 v40.32,285.75
CLK:CLK_SEL  (via drill 0.38)
  Top 0.152: CLK:IC7.1 v39.05,275.59 37.78,276.86 34.29,276.86 33.02,278.13 33.02,285.75 30.48,288.29 CLK:IC4.3 | CLK:IC6.2 v39.05,257.81
  Bottom 0.152: v39.05,275.59 v39.05,257.81
CLK:CLK_STEP  (via drill 0.38)
  Top 0.152: CLK:IC6.5 43.5,266.38 33.34,266.38 32.38,265.43 v26.67,265.43 | v26.67,275.59 27.94,275.59 CLK:IC3.3
  Bottom 0.152: v26.67,265.43 v26.67,275.59
CLK:CLK_TICK
  Top 0.152: CLK:IC6.1 43.5,256.22 32.38,256.22 29.21,259.4 CLK:IC2.3
CLK:N$1
  Top 0.152: CLK:RV2.P$2 CLK:RV2.P$3 12.04,252.73 CLK:C1.+ 20.32,255.59 20.32,259.08 CLK:IC2.6 22.86,260.35 25.4,257.81 CLK:IC2.2
CLK:N$2
  Top 0.152: CLK:R1.1 CLK:R3.2
  Bottom 0.152: CLK:R1.1 18.73,260.67 CLK:IC2.7
CLK:N$3
  Top 0.152: CLK:RV2.P$1 10.85,256.54 14.29,256.54 CLK:R3.1
CLK:N$4
  Bottom 0.152: CLK:R11.2 CLK:LED1.K
CLK:N$6
  Top 0.152: CLK:C2.1 31.43,259.71 29.53,261.62 22.86,261.62 CLK:IC2.5
CLK:N$7
  Top 0.152: CLK:S1.3 7.72,279.3 10.16,276.86 CLK:R6.1 19.05,271.78 20.32,270.51 27.94,270.51 CLK:IC3.2
CLK:N$8
  Top 0.152: CLK:C4.1 17.78,280.67 CLK:IC3.5
CLK:N$11
  Top 0.152: CLK:IC3.7 CLK:IC3.6 26.67,274.32 27.94,273.05 30.48,273.05 31.59,274.16 CLK:C5.1 CLK:R5.1
CLK:N$12
  Top 0.152: CLK:IC4.5 CLK:C7.1
CLK:N$13  (via drill 0.38)
  Top 0.152: CLK:IC7.2 v39.69,278.13 | v39.69,262.89 CLK:IC6.4
  Bottom 0.152: v39.69,278.13 v39.69,262.89
CLK:N$14  (via drill 0.38)
  Top 0.152: v41.91,260.35 CLK:IC6.3 | v41.91,256.86 54.29,256.86 CLK:IC5.1
  Bottom 0.152: v41.91,260.35 v41.91,256.86
CLK:N$15
  Top 0.152: CLK:IC4.2 27.94,287.02 16.51,287.02 15.24,288.29 7.62,288.29 CLK:R9.1 5.08,288.29 5.08,284.48 6.03,283.53 CLK:S2.1
CLK:N$16  (via drill 0.38)
  Top 0.152: CLK:R10.1 12.7,285.75 12.7,283.7 CLK:S2.3 13.83,284.48 v27.94,284.48 | v27.94,290.83 CLK:IC4.4
  Bottom 0.152: v27.94,290.83 v27.94,284.48
CLK:N$17  (via drill 0.38)
  Top 0.152: CLK:IC5.2 54.61,259.08 v42.86,259.08
  Bottom 0.152: v42.86,259.08 42.86,267.65 43.18,267.97 CLK:IC6.6
CLK:N$18  (via drill 0.38)
  Top 0.152: v41.91,267.97 CLK:IC6.9 | CLK:IC5.3 54.61,261.62 v41.91,261.62
  Bottom 0.152: v41.91,261.62 v41.91,267.97
CLK:N$19  (via drill 0.38)
  Top 0.152: CLK:IC7.4 v40.96,283.21 | CLK:IC6.10 40.96,265.43 v40.99,265.4
  Bottom 0.152: v40.99,265.4 40.96,265.43 v40.96,283.21
CLR  (via drill 0.38)
  Top 0.152: ID:IC7.6 v56.83,29.21 | RA:IC2.15 v111.44,229.87 | v111.44,221.3 v100.33,221.3 v59.05,221.3 | v100.33,229.87 RA:IC3.15 | RB:IC3.15 v101.6,119.38 | v113.03,112.71 v101.6,112.71 v59.05,112.71 | v113.03,119.38 RB:IC2.15 | SR:IC2.15 9.84,72.07 19.37,72.07 IR:IC3.15 21.27,70.17 v30.16,70.17 30.8,70.17 IR:IC2.15 | v59.05,59.37 v30.16,59.37 | MAR:IC1.15 32.7,188.28 v59.05,188.28 | v59.05,155.57 ID:TP36.TP
  Bottom 0.152: v59.05,221.3 v59.05,188.28 v59.05,155.57 ID:TP36.TP v59.05,112.71 v59.05,59.37 59.05,52.39 56.83,50.16 v56.83,29.21 | v111.44,229.87 v111.44,221.3 | v100.33,221.3 v100.33,229.87 | v101.6,119.38 v101.6,112.71 | v113.03,112.71 v113.03,119.38 | v30.16,70.17 v30.16,59.37
CY  (via drill 0.38)
  Top 0.152: SR:IC2.14 v13.34,73.66 | v13.34,53.34 v79.38,53.34 | ALU:IC2.9 v79.38,199.39 | v79.38,155.57 SR:TP4.TP
  Bottom 0.152: v13.34,73.66 v13.34,53.34 | v79.38,53.34 SR:TP4.TP v79.38,155.57 v79.38,199.39
D1  (via drill 0.38)
  Top 0.152: RAM:IC6.3 18.1,113.98 v45.4,113.98 | v45.4,134.62 RAM:IC3.18 44.45,135.89 v67.31,135.89 | v108.9,117.79 88.58,117.79 RB:IC1.18 v67.31,116.84 | v108.9,121.92 RB:IC2.14 | v33.34,69.53 42.23,69.53 IR:IC1.18 44.13,69.53 v67.31,69.53 | RA:IC2.14 v112.08,232.41 | v112.08,228.28 87.31,228.28 RA:IC1.18 v67.31,227.33 | PC:IC1.3 104.46,272.73 87.31,272.73 PC:IC2.18 86.04,271.46 v67.31,271.46 | v77.47,282.57 v67.31,282.57 | ALU:IC5.18 v67.31,173.99 | OUT:IC3.3 94.3,87.31 v67.31,87.31 | MAR:IC1.14 32.7,192.72 v67.31,192.72 | v67.31,154.94 TP16.TP
  Bottom 0.152: v45.4,134.62 v45.4,113.98 | v108.9,117.79 v108.9,121.92 | v33.34,69.53 33.34,73.34 33.02,73.66 IR:IC2.14 | v112.08,232.41 v112.08,228.28 | v77.47,282.57 RN1.9 82.87,289.88 LED1.A | v67.31,282.57 v67.31,271.46 v67.31,227.33 v67.31,192.72 v67.31,173.99 v67.31,154.94 TP16.TP v67.31,135.89 v67.31,116.84 v67.31,87.31 v67.31,69.53
D2  (via drill 0.38)
  Top 0.152: RAM:IC6.6 17.78,123.19 19.37,121.6 v46.04,121.6 | RAM:IC3.17 v46.04,137.16 47.31,138.43 v66.67,138.43 | v108.27,120.33 88.58,120.33 RB:IC1.17 v66.67,119.38 | v108.27,123.51 109.54,123.51 RB:IC2.13 | v33.97,70.17 42.23,70.17 IR:IC1.17 44.13,70.17 v66.67,70.17 | v33.97,76.2 IR:IC2.13 | v110.81,228.92 87.31,228.92 RA:IC1.17 v66.67,229.87 | PC:IC1.4 104.46,273.37 87.31,273.37 PC:IC2.17 v66.67,274.32 | v74.93,281.94 v66.67,281.94 | ALU:IC5.17 v66.67,176.53 | OUT:IC3.4 94.3,89.85 v66.67,89.85 | MAR:IC1.13 32.7,195.26 v66.67,195.26 | v66.67,155.57 TP15.TP
  Bottom 0.152: v46.04,137.16 v46.04,121.6 | v108.27,123.51 v108.27,120.33 | v33.97,70.17 v33.97,76.2 | v74.93,281.94 RN1.8 78.42,287.97 LED2.A | v66.67,281.94 v66.67,274.32 v66.67,229.87 v66.67,195.26 v66.67,176.53 v66.67,155.57 TP15.TP v66.67,138.43 v66.67,119.38 v66.67,89.85 v66.67,70.17 | RA:IC2.13 110.49,234.95 110.81,234.63 v110.81,228.92
D3  (via drill 0.38)
  Top 0.152: v44.77,139.7 RAM:IC3.16 44.13,140.65 v66.04,140.65 | v44.77,130.49 v11.11,130.49 | v112.08,122.87 88.58,122.87 RB:IC1.16 v66.04,121.92 | v34.61,74.61 42.23,74.61 IR:IC1.16 44.13,74.61 v66.04,74.61 | v34.61,78.74 IR:IC2.12 | RA:IC2.12 107.95,236.22 v107,236.22 | v107,231.46 87.31,231.46 RA:IC1.16 v66.04,232.41 | PC:IC1.5 104.46,277.81 87.31,277.81 PC:IC2.16 v66.04,276.86 | v11.11,125.73 RAM:IC6.10 | v72.39,281.31 v66.04,281.31 | ALU:IC5.16 v66.04,179.07 | OUT:IC3.7 94.3,97.47 v66.04,97.47 | MAR:IC1.12 32.7,197.8 v66.04,197.8 | v66.04,154.94 TP14.TP
  Bottom 0.152: v44.77,139.7 v44.77,130.49 | RB:IC2.12 111.76,127 112.08,126.68 v112.08,122.87 | v34.61,74.61 v34.61,78.74 | v107,236.22 v107,231.46 | v11.11,130.49 v11.11,125.73 | v72.39,281.31 RN1.7 73.98,286.07 LED3.A | v66.04,281.31 v66.04,276.86 v66.04,232.41 v66.04,197.8 v66.04,179.07 v66.04,154.94 TP14.TP v66.04,140.65 v66.04,121.92 v66.04,97.47 v66.04,74.61
D4  (via drill 0.38)
  Top 0.152: RAM:IC6.13 9.84,119.06 v41.59,119.06 | v41.59,142.24 RAM:IC3.15 48.26,142.24 49.21,143.19 v65.41,143.19 | RB:IC2.11 109.54,128.59 v89.85,128.59 | v89.85,124.46 RB:IC1.15 v65.41,124.46 | v35.24,81.28 IR:IC2.11 | v35.24,75.25 42.23,75.25 IR:IC1.15 44.13,75.25 v65.41,75.25 | v107.63,230.82 v91.76,230.82 | v91.76,234.95 RA:IC1.15 v65.41,234.95 | PC:IC1.6 104.46,278.45 87.31,278.45 PC:IC2.15 v65.41,279.4 | v69.85,280.67 v65.41,280.67 | ALU:IC5.15 v65.41,181.61 | OUT:IC3.8 94.3,100.01 v65.41,100.01 | MAR:IC1.11 32.7,200.34 v65.41,200.34 | v65.41,155.57 TP13.TP
  Bottom 0.152: v41.59,142.24 v41.59,119.06 | v89.85,128.59 v89.85,124.46 | v35.24,75.25 v35.24,81.28 | RA:IC2.11 107.95,240.03 107.63,239.71 v107.63,230.82 | v69.85,280.67 RN1.6 69.53,284.8 LED4.A | v65.41,280.67 v65.41,279.4 v65.41,234.95 v65.41,200.34 v65.41,181.61 v65.41,155.57 TP13.TP v65.41,143.19 v65.41,124.46 v65.41,100.01 v65.41,75.25 | v91.76,230.82 v91.76,234.95
D5  (via drill 0.38)
  Top 0.152: RAM:IC7.3 17.46,138.75 v40.96,138.75 | v40.96,145.73 42.23,145.73 RAM:IC3.14 44.13,145.73 v64.77,145.73 | v97.16,123.51 v89.22,123.51 | RA:IC3.14 96.84,233.36 v88.58,233.36 | v88.58,237.49 RA:IC1.14 v64.77,237.49 | ALU:IC5.14 v64.77,184.15 | RB:IC1.14 v64.77,127 | OUT:IC3.13 v64.77,99.06 | IR:IC3.14 v23.18,73.66 | v64.77,64.45 v23.18,64.45 | v64.77,154.94 TP12.TP
  Bottom 0.152: v40.96,145.73 v40.96,138.75 | RB:IC1.14 88.9,127 89.22,126.68 v89.22,123.51 | v97.16,123.51 97.16,122.56 97.79,121.92 RB:IC3.14 | v88.58,233.36 v88.58,237.49 | v64.77,64.45 v64.77,99.06 v64.77,127 v64.77,145.73 TP12.TP v64.77,154.94 v64.77,184.15 v64.77,237.49 64.77,281.94 RN1.5 65.09,286.7 LED5.A | v23.18,73.66 v23.18,64.45
D6  (via drill 0.38)
  Top 0.152: RAM:IC7.6 18.1,145.73 39.69,145.73 41.27,147.32 RAM:IC3.13 48.58,147.32 49.53,146.37 v64.14,146.37 | v90.49,129.54 RB:IC1.13 v64.14,129.54 | v90.49,125.41 98.11,125.41 RB:IC3.13 | RA:IC3.13 96.84,235.9 v87.95,235.9 | v87.95,240.03 RA:IC1.13 v64.14,240.03 | ALU:IC5.13 v64.14,186.69 | OUT:IC3.14 v64.14,96.52 | IR:IC3.13 v23.81,76.2 | v64.14,62.55 v23.81,62.55 | v64.14,155.57 TP11.TP
  Bottom 0.152: v90.49,129.54 v90.49,125.41 | v87.95,240.03 v87.95,235.9 | v64.14,62.55 v64.14,96.52 v64.14,129.54 v64.14,146.37 TP11.TP v64.14,155.57 v64.14,186.69 v64.14,240.03 64.14,283.85 RN1.4 60.64,288.61 LED6.A | v23.81,76.2 v23.81,62.55
D7  (via drill 0.38)
  Top 0.152: v45.09,149.86 RAM:IC3.12 44.13,148.91 v63.5,148.91 | v45.09,153.67 v10.48,153.67 | v91.12,132.08 RB:IC1.12 v63.5,132.08 | v91.12,126.05 98.11,126.05 RB:IC3.12 | RA:IC3.12 96.84,238.44 v88.58,238.44 | v88.58,242.57 RA:IC1.12 v63.5,242.57 | ALU:IC5.12 v63.5,189.23 | OUT:IC3.17 v63.5,88.9 | IR:IC3.12 v24.45,78.74 | v63.5,61.91 v24.45,61.91 | v63.5,154.94 TP10.TP
  Bottom 0.152: v45.09,153.67 v45.09,149.86 | v91.12,132.08 v91.12,126.05 | v88.58,238.44 v88.58,242.57 | v10.48,153.67 10.48,150.18 10.16,149.86 RAM:IC7.10 | v63.5,61.91 v63.5,88.9 v63.5,132.08 v63.5,148.91 TP10.TP v63.5,154.94 v63.5,189.23 v63.5,242.57 63.5,283.21 RN1.3 56.2,290.51 LED7.A | v24.45,78.74 v24.45,61.91
D8  (via drill 0.38)
  Top 0.152: RAM:IC7.13 9.84,143.19 v45.72,143.19 | RAM:IC3.11 v45.72,152.4 48.26,152.4 49.53,151.13 v62.87,151.13 | v92.39,134.62 RB:IC1.11 v62.87,134.62 | v92.39,131.13 v97.47,131.13 | RA:IC3.11 96.84,240.98 v87.95,240.98 | RA:IC1.11 v62.87,245.11 | ALU:IC5.11 v62.87,191.77 | OUT:IC3.18 v62.87,86.36 | IR:IC3.11 21.59,80.01 v25.08,80.01 | v62.87,60.01 v25.08,60.01 | v62.87,155.57 TP9.TP
  Bottom 0.152: v45.72,152.4 v45.72,143.19 | v92.39,134.62 v92.39,131.13 | v97.47,131.13 97.47,129.86 97.79,129.54 RB:IC3.11 | v87.95,240.98 87.95,244.79 87.63,245.11 RA:IC1.11 | v62.87,60.01 v62.87,86.36 v62.87,134.62 v62.87,151.13 TP9.TP v62.87,155.57 v62.87,191.77 v62.87,245.11 62.87,281.31 RN1.2 57.78,286.38 56.2,286.38 LED8.A | v25.08,80.01 v25.08,60.01
GND  (via drill 0.38)
  Top 0.254: ID:IC1.19 ID:IC1.18 | v104.14,219.71 v104.78,219.71 v108.27,219.71 v108.9,219.71 | RB:IC3.8 107.95,133.35 116.84,133.35 RB:IC2.8 | v95.25,136.53 v95.89,136.53 v101.92,136.53 v102.55,136.53 | v32.7,154.31 v33.34,154.31 v38.42,154.31 v39.05,154.31
  pour Bottom (isolate 0.254): 135,295.5 135,4.5 arc-90 130.5,0 4.5,0 arc-90 0,4.5 0,295.5 arc-90 4.5,300 130.5,300 arc-90
HLT  (via drill 0.38)
  Top 0.152: v76.52,32.07 v69.85,32.07 v63.5,32.07 | v69.85,272.1 v42.23,272.1 | v69.85,155.57 ID:TP19.TP | CLK:IC7.3 v42.23,280.67
  Bottom 0.152: v76.52,32.07 76.52,25.72 ID:HLT.A | v63.5,32.07 ID:IC1.9 | v69.85,272.1 v69.85,155.57 ID:TP19.TP v69.85,32.07 | v42.23,280.67 v42.23,272.1
ID:!T0  (via drill 0.38)
  Top 0.152: ID:IC6.15 14.29,17.46 v6.35,17.46
  Bottom 0.152: v6.35,17.46 ID:T0.A
ID:!T1  (via drill 0.38)
  Top 0.152: ID:IC6.14 v13.09,19.05
  Bottom 0.152: v13.09,19.05 13.09,35.81 ID:T1.A
ID:!T2  (via drill 0.38)
  Top 0.152: ID:IC6.13 v13.65,21.59
  Bottom 0.152: v13.65,21.59 13.65,36.51 ID:T2.A
ID:!T3  (via drill 0.38)
  Top 0.152: ID:IC6.12 16.19,25.08 v19.68,25.08
  Bottom 0.152: v19.68,25.08 ID:T3.A
ID:!T4  (via drill 0.38)
  Top 0.152: ID:IC6.11 16.19,27.62 v24.45,27.62
  Bottom 0.152: v24.45,27.62 24.45,37.78 ID:T4.A
ID:AI  (via drill 0.38)
  Top 0.152: ID:IC3.13 v107.63,17.78 | ID:AI.A 105.73,25.72 v100.01,25.72 | v100.01,37.47 v69.22,37.47 | v60.96,46.67 v69.22,46.67
  Bottom 0.152: v107.63,17.78 107.63,23.81 ID:AI.A | v69.22,46.67 v69.22,37.47 | v100.01,37.47 v100.01,25.72 | ID:IC1.17 v60.96,46.67
ID:AO  (via drill 0.38)
  Top 0.152: ID:IC3.11 110.17,23.18 v102.87,23.18 | v100.65,38.1 v63.5,38.1
  Bottom 0.152: v102.87,23.18 102.23,23.81 ID:AO.A 100.33,26.67 100.33,36.83 100.65,37.15 v100.65,38.1 | v63.5,38.1 ID:IC1.16
ID:BI  (via drill 0.38)
  Top 0.152: v126.36,20.32 ID:IC4.3 | v126.36,10.48 v82.55,10.48 | v68.58,13.02 v82.55,13.02
  Bottom 0.152: ID:BI.A 82.55,20.32 v82.55,13.02 v82.55,10.48 | v126.36,10.48 v126.36,20.32 | ID:IC2.11 v68.58,13.02
ID:CO  (via drill 0.38)
  Top 0.152: ID:CO.A 96.84,23.18 v66.04,23.18 | v100.33,11.11 v127,11.11 | v127,25.4 ID:IC4.5
  Bottom 0.152: v66.04,23.18 ID:IC2.15 | ID:CO.A 100.33,19.68 v100.33,11.11 | v127,11.11 v127,25.4
ID:EO  (via drill 0.38)
  Top 0.152: ID:EO.A v62.55,22.23 | v77.15,9.84 v129.54,9.84
  Bottom 0.152: v62.55,22.23 62.55,11.11 ID:IC2.9 | ID:EO.A 77.15,20.64 v77.15,9.84 | v129.54,9.84 ID:IC4.1
ID:FI  (via drill 0.38)
  Top 0.152: ID:IC4.11 120.97,21.91 107,21.91 ID:FI.A | v105.41,14.29 v60.96,14.29
  Bottom 0.152: ID:FI.A 105.41,20.95 v105.41,14.29 | v60.96,14.29 ID:IC2.17
ID:II  (via drill 0.38)
  Top 0.152: ID:II.A 98.74,23.81 v112.08,23.81 | v95.25,39.37 v66.04,39.37
  Bottom 0.152: v112.08,23.81 112.08,27.62 111.76,27.94 ID:IC3.9 | ID:II.A 95.25,27.3 v95.25,39.37 | v66.04,39.37 ID:IC1.15
ID:IO  (via drill 0.38)
  Top 0.152: ID:IC3.5 117.16,26.35 94.93,26.35 ID:IO.A | v92.39,38.73 v68.58,38.73
  Bottom 0.152: ID:IO.A 92.39,25.72 v92.39,38.73 | v68.58,38.73 ID:IC1.14
ID:JP  (via drill 0.38)
  Top 0.152: v103.5,13.65 v63.5,13.65 | v120.33,27.94 ID:IC4.9 | ID:JP.A 103.19,21.27 v120.33,21.27
  Bottom 0.152: ID:JP.A 103.5,20.95 v103.5,13.65 | v63.5,13.65 ID:IC2.16 | v120.33,27.94 v120.33,21.27
ID:MI  (via drill 0.38)
  Top 0.152: v90.17,23.81 80.96,23.81 ID:MI.A 79.06,23.81 v67.31,23.81 | v90.17,11.75 114.62,11.75 ID:IC3.1
  Bottom 0.152: v90.17,23.81 v90.17,11.75 | v67.31,23.81 67.31,33.02 ID:IC1.10
ID:MI1  (via drill 0.38)
  Top 0.152: v20,20 4.76,20 ID:IC5.14 | v20,13.97 ID:IC6.1 | v60.01,18.1 v20,18.1
  Bottom 0.152: v20,20 v20,18.1 v20,13.97 | ID:IC2.8 60.01,11.11 v60.01,18.1 60.01,33.34 ID:IC1.8
ID:MI2  (via drill 0.38)
  Top 0.152: ID:IC5.13 4.76,22.54 v20.64,22.54 | v20.64,16.51 ID:IC6.2 | v20.64,12.38 v57.47,12.38
  Bottom 0.152: v20.64,22.54 v20.64,16.51 v20.64,12.38 | ID:IC2.7 57.47,11.11 v57.47,12.38 57.47,33.34 ID:IC1.7
ID:MI3  (via drill 0.38)
  Top 0.152: ID:IC5.12 4.76,23.18 v21.27,23.18 | v24.45,11.75 v54.93,11.75
  Bottom 0.152: v21.27,23.18 21.27,19.37 21.59,19.05 ID:IC6.3 24.13,19.05 24.45,18.73 v24.45,11.75 | ID:IC2.6 54.93,11.11 v54.93,11.75 54.93,33.34 ID:IC1.6
ID:N$1  (via drill 0.38)
  Top 0.152: ID:HLT.K 76.52,28.26 v83.5,28.26
  Bottom 0.152: v83.5,28.26 ID:RN1.2
ID:N$2  (via drill 0.38)
  Top 0.152: ID:MI.K 80.96,26.35 v86.04,26.35
  Bottom 0.152: v86.04,26.35 ID:RN1.3
ID:N$3  (via drill 0.38)
  Top 0.152: ID:RO.K 85.09,27.94 v87.95,27.94
  Bottom 0.152: v87.95,27.94 87.95,30.16 ID:RN1.4
ID:N$4  (via drill 0.38)
  Top 0.152: v91.12,27.3 ID:RI.K
  Bottom 0.152: ID:RN1.5 v91.12,27.3
ID:N$5
  Bottom 0.152: ID:RN1.6 93.66,27.62 ID:IO.K
ID:N$6  (via drill 0.38)
  Top 0.152: v96.2,27.3 ID:II.K
  Bottom 0.152: ID:RN1.7 v96.2,27.3
ID:N$7  (via drill 0.38)
  Top 0.152: ID:AO.K v99.06,27.3
  Bottom 0.152: v99.06,27.3 98.74,27.62 ID:RN1.8
ID:N$8  (via drill 0.38)
  Top 0.152: v106.68,30.8 ID:RN1.9
  Bottom 0.152: ID:AI.K v106.68,30.8
ID:N$9
  Top 0.152: ID:EO.K 76.83,18.41 81.28,18.41 ID:RN2.2
ID:N$10
  Top 0.152: ID:SU.K 82.55,19.68 ID:RN2.3
ID:N$11
  Top 0.152: ID:BI.K 85.09,19.68 ID:RN2.4
ID:N$12
  Top 0.152: ID:OI.K 91.12,17.46 ID:RN2.5
ID:N$13
  Top 0.152: ID:CE.K 93.66,19.37 ID:RN2.6
ID:N$14
  Top 0.152: ID:CO.K 96.2,18.1 ID:RN2.7
ID:N$15
  Top 0.152: ID:JP.K ID:RN2.8
ID:N$16
  Bottom 0.152: ID:R17.2 ID:IC7.1 ID:IC7.2 35.88,20.64 35.88,36.57 ID:S1.3
ID:N$17  (via drill 0.38)
  Top 0.152: ID:IC5.1 12.38,14.92 v25.08,14.92 | v25.08,22.86 25.4,22.86 ID:IC7.11
  Bottom 0.152: v25.08,22.86 v25.08,14.92
ID:N$18
  Bottom 0.152: ID:IC7.13 ID:IC7.12 27.94,21.59 28.26,21.91 28.26,31.43 27.94,31.75 ID:IC7.8
ID:N$19
  Top 0.152: ID:IC6.10 16.19,28.26 25.72,28.26 ID:IC7.9
ID:N$31
  Top 0.152: ID:FI.K 103.19,16.19 ID:RN2.9
ID:N$33
  Top 0.152: ID:T2.K 17.14,42.55 ID:RN3.4
ID:N$34
  Top 0.152: ID:T4.K 22.23,42.55 ID:RN3.2
ID:N$35
  Top 0.152: ID:T3.K ID:RN3.3
ID:N$36
  Top 0.152: ID:RN3.5 11.11,40.64 ID:T1.K
ID:N$37
  Top 0.152: ID:T0.K 8.57,40.64 ID:RN3.6
ID:RO  (via drill 0.38)
  Top 0.152: v87.31,32.7 v116.52,32.7 | v82.55,32.7 68.9,32.7 68.58,33.02 ID:IC1.11 | v87.31,24.77 ID:RO.A
  Bottom 0.152: v87.31,32.7 v87.31,24.77 | ID:RO.A 82.55,26.67 v82.55,32.7 | v116.52,32.7 116.52,20.64 116.84,20.32 ID:IC3.3
IR:B1  (via drill 0.38)
  Top 0.152: IR:IC2.3 v41.52,73.66 | v41.52,66.99 49.85,66.99 IR:IC1.2
  Bottom 0.152: v41.52,66.99 41.52,73.59 v41.52,73.66 41.52,89.78 43.18,91.44 46.99,91.44 IR:LED1.A
IR:B2  (via drill 0.38)
  Top 0.152: v40.96,67.63 49.85,67.63 IR:IC1.3
  Bottom 0.152: IR:IC2.4 40.64,76.2 | 40.64,76.2 40.96,75.88 v40.96,67.63 | 40.64,76.2 40.96,76.52 40.96,91.12 42.55,92.71 IR:LED2.A
IR:B3  (via drill 0.38)
  Top 0.152: IR:IC2.5 40.32,79.69 v45.72,79.69 | v45.72,71.12 IR:IC1.4
  Bottom 0.152: v45.72,79.69 v45.72,71.12 | IR:LED3.A 37.78,91.12 37.78,79.06 38.1,78.74 IR:IC2.5
IR:B4  (via drill 0.38)
  Top 0.152: v45.09,80.33 40.32,80.33 IR:IC2.6 38.42,82.23 v35.24,82.23 | v45.09,73.66 IR:IC1.5
  Bottom 0.152: v45.09,80.33 v45.09,73.66 | IR:LED4.A 35.24,92.39 v35.24,82.23
IR:N$1
  Top 0.152: IR:LED8.K 19.68,97.79 IR:RN3.9
IR:N$2
  Top 0.152: IR:LED7.K 22.54,95.25 IR:RN3.8
IR:N$3
  Top 0.152: IR:LED6.K 27.62,96.84 IR:RN3.7
IR:N$5
  Top 0.152: IR:LED5.K 30.16,95.57 IR:RN3.6
IR:N$6
  Top 0.152: IR:LED4.K 32.7,97.47 IR:RN3.5
IR:N$7
  Top 0.152: IR:LED3.K 38.1,95.25 35.56,97.79 IR:RN3.4
IR:N$8
  Top 0.152: IR:LED2.K 40.96,95.25 38.42,97.79 IR:RN3.3
IR:N$9
  Top 0.152: IR:LED1.K 46.99,95.25 46.04,96.2 41.91,96.2 IR:RN3.2
MAR:I5
  Top 0.152: MAR:IC1.3 40.32,190.82 49.85,190.82 MAR:IC2.3
MAR:I6  (via drill 0.38)
  Top 0.152: MAR:IC2.6 50.8,199.07 50.16,198.44 v40.96,198.44
  Bottom 0.152: v40.96,198.44 40.96,194.63 40.64,194.31 MAR:IC1.4
MAR:I7  (via drill 0.38)
  Top 0.152: v37.78,200.98 42.23,200.98 MAR:IC2.10
  Bottom 0.152: v37.78,200.98 37.78,197.17 38.1,196.85 MAR:IC1.5
MAR:I8  (via drill 0.38)
  Top 0.152: MAR:IC1.6 v41.52,199.39
  Bottom 0.152: v41.52,199.39 41.52,194.7 41.91,194.31 MAR:IC2.13
MAR:N$1  (via drill 0.38)
  Top 0.152: v52.39,171.45 39.37,171.45 MAR:S1.8 | v52.39,189.23 MAR:IC2.2
  Bottom 0.152: MAR:S1.8 38.42,168.59 MAR:RN2.2 | v52.39,189.23 v52.39,171.45
MAR:N$2
  Top 0.152: MAR:LED4.K 36.51,214.95 MAR:RN1.5
MAR:N$3  (via drill 0.38)
  Top 0.152: MAR:S1.7 37.47,172.09 v48.58,172.09 | v48.58,196.85 MAR:IC2.5
  Bottom 0.152: MAR:S1.7 35.88,168.59 MAR:RN2.3 | v48.58,196.85 v48.58,172.09
MAR:N$4
  Top 0.152: MAR:LED3.K 39.05,213.68 MAR:RN1.4
MAR:N$5  (via drill 0.38)
  Top 0.152: MAR:S1.6 35.56,172.72 v47.94,172.72 | v47.94,199.39 MAR:IC2.11
  Bottom 0.152: MAR:S1.6 33.34,168.59 MAR:RN2.4 | v47.94,199.39 v47.94,172.72
MAR:N$7
  Top 0.152: MAR:R10.2 15.88,189.37 MAR:S3.3
MAR:N$8
  Top 0.152: MAR:LED2.K 41.59,215.58 MAR:RN1.3
MAR:N$9
  Bottom 0.152: MAR:PROG.K 7.62,202.88 MAR:R9.1
MAR:N$10
  Top 0.152: MAR:LED1.K 46.67,213.36 MAR:RN1.2
MAR:N$11  (via drill 0.38)
  Top 0.152: MAR:S1.5 33.66,173.35 v47.31,173.35 | v47.31,191.77 MAR:IC2.14
  Bottom 0.152: MAR:S1.5 30.8,168.59 MAR:RN2.5 | v47.31,191.77 v47.31,173.35
MAR:N$13
  Bottom 0.152: MAR:RUN.K 15.88,202.88 MAR:R10.1
N$1  (via drill 0.38)
  Top 0.152: RA:IC3.6 103.82,241.62 v102.23,241.62 94.93,241.62 RA:IC1.9 | RA:LED8.A 87.63,250.19 v92.39,250.19 | ALU:IC2.12 v102.55,191.77
  Bottom 0.152: v92.39,250.19 92.39,242.89 92.71,242.57 RA:IC1.9 | v102.55,191.77 102.55,210.5 102.23,210.82 v102.23,241.62
N$2  (via drill 0.38)
  Top 0.152: RA:IC3.5 103.82,239.08 v101.6,239.08 94.93,239.08 RA:IC1.8 v90.81,240.03 | ALU:IC2.14 v101.92,186.69
  Bottom 0.152: RA:LED7.A v90.81,240.03 | v101.6,239.08 101.6,210.5 101.92,210.19 v101.92,186.69
N$3  (via drill 0.38)
  Top 0.152: RA:IC3.4 103.82,236.54 v102.87,236.54 94.93,236.54 RA:IC1.7 | ALU:IC2.3 v103.19,186.69
  Bottom 0.152: RA:LED6.A 95.57,251.14 95.57,237.81 95.25,237.49 RA:IC1.7 | v102.87,236.54 102.87,214.63 104.14,213.36 104.14,210.82 103.19,209.87 v103.19,186.69
N$4  (via drill 0.38)
  Top 0.152: RA:IC3.3 103.82,234 94.93,234 RA:IC1.6 | RA:LED5.A 100.97,250.19 v103.82,250.19
  Bottom 0.152: v103.82,250.19 103.82,232.73 104.14,232.41 RA:IC3.3 105.41,231.78 107,230.19 107,192.09 106.68,191.77 ALU:IC2.5
N$5  (via drill 0.38)
  Top 0.152: RA:IC2.6 v113.35,240.03 | v113.35,223.2 v92.39,223.2 v84.45,223.2 | v113.35,250.19 105.41,250.19 RA:LED4.A | ALU:IC1.12 v84.45,167.64
  Bottom 0.152: v113.35,223.2 v113.35,240.03 v113.35,250.19 | v92.39,223.2 92.39,232.09 92.71,232.41 RA:IC1.5 | v84.45,167.64 v84.45,223.2
N$6  (via drill 0.38)
  Top 0.152: RA:IC2.5 v113.98,237.49 | v113.98,223.84 v95.89,223.84 | v95.89,229.87 RA:IC1.4 91.44,229.87 90.49,230.82 v83.82,230.82 | RA:LED3.A 109.86,252.73 v113.98,252.73 | ALU:IC1.14 v83.82,162.56
  Bottom 0.152: v113.98,223.84 v113.98,237.49 v113.98,252.73 | v95.89,229.87 v95.89,223.84 | v83.82,230.82 v83.82,162.56
N$7  (via drill 0.38)
  Top 0.152: v115.25,226.38 v112.71,226.38 94.93,226.38 RA:IC1.3 v89.85,227.33 | ALU:IC1.3 104.46,161.61 v89.85,161.61
  Bottom 0.152: RA:IC2.4 115.57,234.95 115.25,234.63 v115.25,226.38 | RA:LED2.A 112.71,251.14 v112.71,226.38 | v89.85,161.61 v89.85,227.33
N$8  (via drill 0.38)
  Top 0.152: v114.62,225.74 94.93,225.74 RA:IC1.2 v89.22,224.79 | RA:IC2.3 v114.62,232.41 | v89.22,155.89 v103.19,155.89 | v103.19,167.64 ALU:IC1.5
  Bottom 0.152: v114.62,225.74 v114.62,232.41 114.62,248.6 RA:LED1.A | v89.22,224.79 v89.22,155.89 | v103.19,155.89 103.19,163.83 v103.19,167.64
N$9  (via drill 0.38)
  Top 0.152: RB:IC1.2 96.2,115.25 v115.25,115.25 | v115.25,121.92 RB:IC2.3 | v119.7,158.12 126.36,158.12 ALU:IC3.1
  Bottom 0.152: v115.25,115.25 v115.25,121.92 | RB:IC2.3 119.38,121.92 119.7,122.24 119.7,140.02 RB:LED1.A 119.7,141.92 v119.7,158.12
N$10  (via drill 0.38)
  Top 0.152: RB:IC1.3 96.2,115.89 v115.89,115.89 | v115.89,124.46 RB:IC2.4 | v118.43,168.91 127,168.91 ALU:IC3.4
  Bottom 0.152: v115.89,115.89 v115.89,124.46 115.89,139.38 RB:LED2.A 118.43,145.1 v118.43,168.91
N$11  (via drill 0.38)
  Top 0.152: RB:IC1.4 96.2,118.43 v116.52,118.43 | RB:LED3.A 111.12,139.7 v116.52,139.7 | v112.39,174.31 119.06,174.31 ALU:IC3.9
  Bottom 0.152: v116.52,118.43 116.52,126.68 116.84,127 | 116.84,127 RB:IC2.5 | v116.52,139.7 116.52,127.32 116.84,127 | RB:LED3.A 111.76,142.88 111.76,164.15 112.39,164.78 v112.39,174.31
N$12  (via drill 0.38)